# EasyEDA Pro project FD-MGS-A.eprj

# Schematic 光栅光谱仪
Board Name: FD-MGS-A; Create Date: 2025-05-20; Page Name: P1; Project Name: guangsha; Schematic Name: 光栅光谱仪; Update Date: 2025-08-22; Company: 嘉立创EDA; Page Size: A4; Version: V1.0
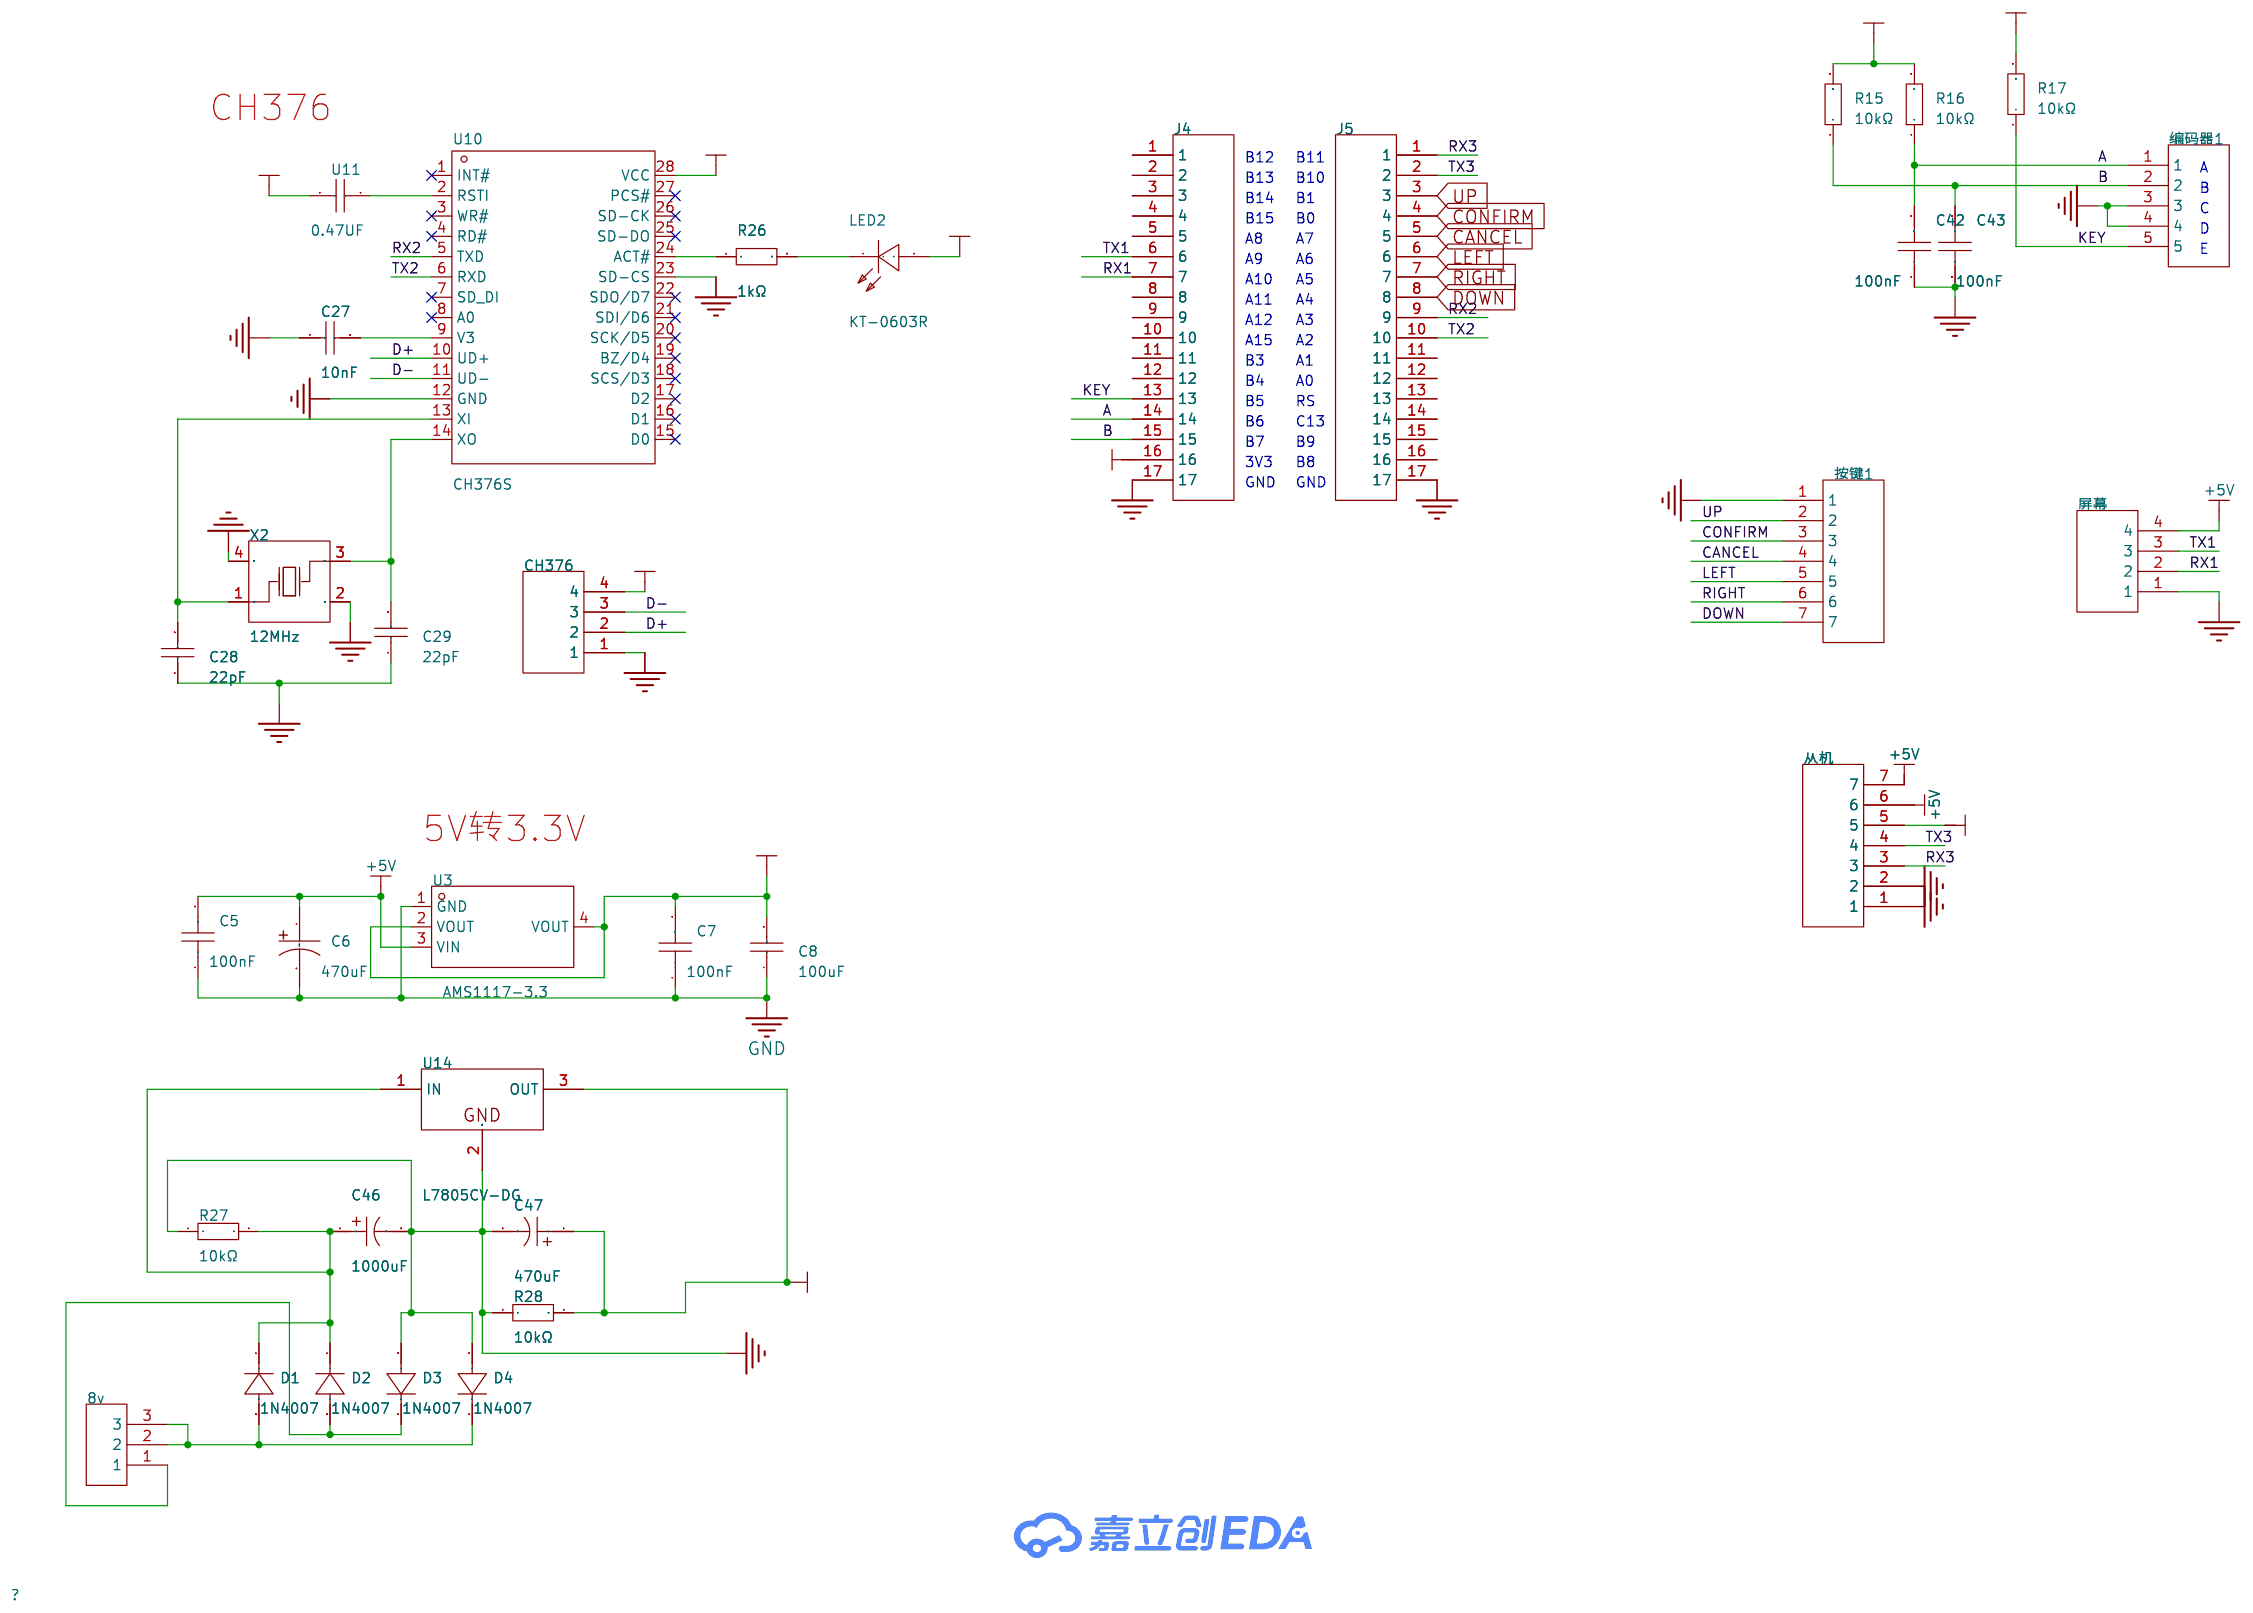
[diagram p0: schematic sheet]

## Parts
8v  -  [CH2.54-3插座]
C5  100nF  [C0603]
C6  470uF  [cap-th_bd8.0-p3.50-d0.6-fd_1]
C7  100nF  [C0603]
C8  100uF  [C1206]
C27  10nF  [C0603]
C28  22pF  [C0603]
C29  22pF  [C0603]
C42  100nF  [C0402]
C43  100nF  [C0402]
C46  1000uF  [CAP-TH_BD10.0-P5.00-D0.6-FD]
C47  470uF  [CAP-TH_BD8.0-P3.50-D0.5-FD]
CH376  -  [CH2.54-4插座]
D1  1N4007  [DO-41_BD2.4-L4.7-P8.70-D0.8-RD]
D2  1N4007  [DO-41_BD2.4-L4.7-P8.70-D0.8-RD]
D3  1N4007  [DO-41_BD2.4-L4.7-P8.70-D0.8-RD]
D4  1N4007  [DO-41_BD2.4-L4.7-P8.70-D0.8-RD]
J4  -  [CH2.54-17P]
J5  -  [CH2.54-17P]
LED2  KT-0603R  [LED0603-RD]
R15  10kΩ  [R0805]
R16  10kΩ  [R0805]
R17  10kΩ  [R0805]
R26  1kΩ  [R0603]
R27  10kΩ  [Res_1/8W]
R28  10kΩ  [Res_1/8W]
U3  AMS1117-3.3  [SOT-223-3_L6.5-W3.4-P2.30-LS7.0-BR]
U10  CH376S  [SOIC-28_L17.9-W7.5-P1.27-LS10.3-BL]
U11  0.47UF  [C0603]
U14  L7805CV-DG  [TO-220-3_L10.0-W4.5-P2.54-L]
X2  12MHz  [CRYSTAL-SMD_4P-L3.2-W2.5-BL]
从机  -  [CH2.54-7插座]
屏幕  -  [CH2.54-4插座]
按键1  -  [CH2.54-7插座]
编码器1  -  [CH2.54-5插座]

## Library data of the parts
8v = HDR-3P
C5 C7 = CAP_0603: Supplier Footprint: 0603
C6 = RVT1A471M0607_C335982: 容值:470uF;精度:±20%;额定电压:10V;纹波电流:200mA@120Hz;等效串联电阻:-;; LCSC Part Name: 470uF ±20% 10V; Supplier Part: C335982; Manufacturer: ROQANG(容强); Manufacturer Part: RVT1A471M0607; Supplier Footprint: SMD,D6.3xL7.7mm; Datasheet: https://atta.szlcsc.com/upload/public/pdf/source/20181128/C335987_23CA7AA50FB42690DF736C43FE112376.pdf; Supplier: LCSC; Tolerance: ±20%; Rated Voltage: 10V; Ripple Current: 200mA@120Hz; φD: 6.3mm; L: 7.7mm; Lifetime @ Temp: 2000hrs@105℃; Operating Temperature: -40℃~+105℃
C8 = CL31A107MQHNNNE: 容值:100uF;精度:±20%;额定电压:6.3V;材质(温度系数):X5R;; LCSC Part Name: 100uF ±20% 6.3V; Supplier Part: C15008; Manufacturer: SAMSUNG(三星); Supplier Footprint: 1206; Datasheet: https://atta.szlcsc.com/upload/public/pdf/source/20160218/1457707763339.pdf; Supplier: LCSC; Tolerance: ±20%; Voltage Rated: 6.3V; Temperature Coefficient: X5R
C27 = 0603B103K500NT: 容值:10nF;精度:±10%;额定电压:50V;材质(温度系数):X7R;; LCSC Part Name: 10nF ±10% 50V; Supplier Part: C57112; Manufacturer: FH(风华); Supplier Footprint: 0603; JLCPCB Part Class: 基础库; Datasheet: https://atta.szlcsc.com/upload/public/pdf/source/20200305/C486355_26A10D38EF8C2A5C37091D0039909270.pdf; Supplier: LCSC; Tolerance: ±10%; Voltage Rated: 50V; Temperature Coefficient: X7R
C28 C29 = CL10C220JB8NNNC: 容值:22pF;精度:±5%;额定电压:50V;材质(温度系数):C0G;; LCSC Part Name: 22pF ±5% 50V; Supplier Part: C1653; Manufacturer: SAMSUNG(三星); Supplier Footprint: 0603; JLCPCB Part Class: 基础库; Datasheet: https://atta.szlcsc.com/upload/public/pdf/source/20160218/1457707763339.pdf; Supplier: LCSC; Tolerance: ±5%; Voltage Rated: 50V; Temperature Coefficient: C0G
C42 C43 = CL05B104KB54PNC: 容值:100nF;精度:±10%;额定电压:50V;材质(温度系数):X7R;; LCSC Part Name: 100nF ±10% 50V; Supplier Part: C307331; Manufacturer: SAMSUNG(三星); Supplier Footprint: 0402; JLCPCB Part Class: 基础库; Datasheet: https://atta.szlcsc.com/upload/public/pdf/source/20160218/1457707763339.pdf; Supplier: LCSC; Tolerance: ±10%; Voltage Rated: 50V; Temperature Coefficient: X7R
C46 = CD288108M1V1020VFL: 容值:1000uF;额定电压:35V;; LCSC Part Name: 1000uF 35V; Supplier Part: C7499950; Manufacturer: HRK(鸿瑞凯电子); Supplier Footprint: 插件,D10xL20mm; JLCPCB Part Class: 扩展库; Datasheet: https://item.szlcsc.com/datasheet/CD288108M1V1020VFL/8575810.html; Supplier: LCSC; Voltage Rating: 35V; Diameter: 10mm; Height - Seated (Max): 20mm
C47 = 16V470uF CD288: 容值:470uF;精度:±20%;额定电压:16V;; LCSC Part Name: 470uF ±20% 16V; Supplier Part: C2960229; Manufacturer: HRK(鸿瑞凯电子); Supplier Footprint: 插件,D8xL12mm; JLCPCB Part Class: 扩展库; Supplier: LCSC; Tolerance: ±20%; Voltage Rating: 16V; Pin Spacing: 3.5mm; Diameter: 8mm; Height - Seated (Max): 12mm; Operating Temperature: -40℃~+105℃
CH376 屏幕 = HDR-4P
D1-D4 = 1N4007_C2985028: 二极管配置:独立式;正向压降(Vf):1V@1A;直流反向耐压(Vr):1kV;整流电流:1A;; LCSC Part Name: 电压:1kV 电流:1A; Supplier Part: C2985028; Manufacturer: GOODWORK(固得沃克); Supplier Footprint: DO-41; JLCPCB Part Class: 扩展库; Datasheet: https://item.szlcsc.com/datasheet/1N4007/3428711.html; Supplier: LCSC; Diode Configuration: 独立式; Voltage - Forward(Vf@If): 1V@1A; Voltage - DC Reverse(Vr): 1kV; Current - Rectified: 1A; Reverse Leakage Current (Ir): 5uA@1kV; Non-Repetitive Peak Forward Surge Current: 30A; Operating Junction Temperature Range: -65℃~+150℃
J4 J5 = HDR-17P
LED2 = KT-0603R: 发光颜色:红色;功率:-;正向电流:-;主波长:-;二极管配置:-;透镜颜色:-;色温:-;发光角度:-;载带方式:-;工作温度:-40℃~+85℃;; LCSC Part Name: 0603 红灯 高亮; Supplier Part: C2286; Manufacturer: KENTO; Supplier Footprint: 0603; JLCPCB Part Class: 基础库; Datasheet: https://atta.szlcsc.com/upload/public/pdf/source/20160616/1466072038404.pdf; Supplier: LCSC; Emitted Color: 红色; Operating Temperature: -40℃~+85℃
R15-R17 = 0805W8F1002T5E_C17414: 电阻类型:厚膜电阻;阻值:10kΩ;精度:±1%;功率:125mW;最大工作电压:150V;温度系数:±100ppm/℃;; LCSC Part Name: 10kΩ ±1% 125mW 厚膜电阻; Supplier Part: C17414; Manufacturer: UNI-ROYAL(厚声); Manufacturer Part: 0805W8F1002T5E; Supplier Footprint: 0805; JLCPCB Part Class: 基础库; Datasheet: https://atta.szlcsc.com/upload/public/pdf/source/20200306/C422600_1E6D84923E4A46A82E41ADD87F860B5C.pdf; Supplier: LCSC; Type: 厚膜电阻; Tolerance: ±1%; Power(Watts): 125mW; Overload Voltage (Max): 150V; Temperature Coefficient: ±100ppm/℃; Operating Temperature Range: -55℃~+155℃
R26 = 0603WAF1001T5E: 电阻类型:厚膜电阻;阻值:1kΩ;精度:±1%;功率:100mW;最大工作电压:75V;温度系数:±100ppm/℃;; LCSC Part Name: 1kΩ ±1% 100mW 厚膜电阻; Supplier Part: C21190; Manufacturer: UNI-ROYAL(厚声); Supplier Footprint: 0603; JLCPCB Part Class: 基础库; Datasheet: https://atta.szlcsc.com/upload/public/pdf/source/20200306/C422600_1E6D84923E4A46A82E41ADD87F860B5C.pdf; Supplier: LCSC; Type: 厚膜电阻; Tolerance: ±1%; Power(Watts): 100mW; Overload Voltage (Max): 75V; Temperature Coefficient: ±100ppm/℃; Operating Temperature Range: -55℃~+155℃
R27 R28 = Res_AXIAL-1/8W: Supplier Footprint: 轴向引线
U3 = AMS1117-3.3_C6186: 输出类型:固定;最大输入电压:-;输出电压:3.3V;最大输出电流:1A;电源纹波抑制比(PSRR):72dB@(120Hz);输出极性:正极;; LCSC Part Name: 输出3.3V 1A; Supplier Part: C6186; Manufacturer: AMS; Supplier Footprint: SOT-223; Datasheet: https://atta.szlcsc.com/upload/public/pdf/source/20180727/C6186_7A095716F0823C02F1997A905E26C086.pdf; Supplier: LCSC; Output Type: 固定; Output Voltage: 3.3V; MAX Output Current: 1A; Power Supply Rejection Ratio (PSRR): 72dB@(120Hz); Dropout Voltage: 1.3V@(800mA); Output Polarity: 正极; Number of Outputs: 1
U10 = CH376S: 应用功能:-;接口协议:USB 2.0;数据速率:12Mbps;; Supplier Part: C14166; Manufacturer: WCH(南京沁恒); Supplier Footprint: SOP-28-300mil; JLCPCB Part Class: 扩展库; Datasheet: https://atta.szlcsc.com/upload/public/pdf/source/20240313/780B8519D8DF2DCF0D579C39FFA4C063.pdf; Supplier: LCSC; Protocol: USB 2.0; Voltage - Supply: 3.3V；5V; Data Rate: 12Mbps; Supply Voltage: 3.3V；5V
U11 = CAPCER0.47UF25VX7R0603: Supplier Part: C9900012837; JLCPCB Part Class: 扩展库; Supplier: LCSC
U14 = L7805CV-DG: 输出类型:固定;最大输入电压:35V;输出电压:5V;输出电流:1.5A;电源纹波抑制比(PSRR):62dB@(120Hz);输出极性:正极;; LCSC Part Name: 正稳压器IC; Supplier Part: C3795; Manufacturer: ST(意法半导体); Supplier Footprint: TO-220; JLCPCB Part Class: 扩展库; Datasheet: https://atta.szlcsc.com/upload/public/pdf/source/20140724/1457707163191.pdf; Supplier: LCSC; Output Type: 固定; Maximum Input Voltage: 35V; Output Voltage: 5V; Output Current: 1.5A; Power Supply Rejection Ratio (PSRR): 62dB@(120Hz); Dropout Voltage: 2V@(1A); standby current: 8mA; Feature: 短路保护；热保护(TSD)；过流保护(OCP); Operating Temperature: 0℃~+125℃; Output Polarity: 正极; Number of Outputs: 1
X2 = X322512MSB4SI: 晶振类型:贴片晶振;频率:12MHz;常温频差:±10ppm;外接负载电容:20pF;频率稳定度(全温):±20ppm;; LCSC Part Name: 12MHz ±10ppm 20pF; Supplier Part: C9002; Manufacturer: YXC(扬兴晶振); Supplier Footprint: SMD3225-4P; JLCPCB Part Class: 基础库; Datasheet: https://atta.szlcsc.com/upload/public/pdf/source/20240329/19D5F850207469550BEB00D7DFEDBC7A.pdf; Supplier: LCSC; Crystal Type: 贴片晶振; Normal temperature Frequency Tolerance: ±10ppm; External load capacitor: 20pF; Frequency Stability(Full temperature range): ±20ppm; Operating Temperature: -40℃~+85℃
从机 按键1 = HDR-7P
编码器1 = HDR-5P

## Nets
+3V3: C7.2 C8.2 J4.16 LED2.2(A) R15.2 R16.2 R17.2 U3.2(VOUT) U3.4(VOUT) U10.28(VCC) U11.1 从机.5
+5V: C5.2 C6.1 C47.1 CH376.4 R28.2 U3.3(VIN) U14.3(OUT) 从机.6 从机.7 屏幕.4
GND: C5.1 C6.2 C7.1 C8.1 C27.1 C28.1 C29.1 C42.1 C43.1 C46.2 C47.2 CH376.1 D3.2(A) D4.2(A) J4.17 J5.17 R27.1 R28.1 U3.1(GND) U10.12(GND) U10.23(SD-CS) U14.2(GND) X2.2(GND) X2.4(GND) 从机.1 从机.2 屏幕.1 按键1.1 编码器1.3 编码器1.4
A: C42.2 J4.14 R16.1 编码器1.1
B: C43.2 J4.15 R15.1 编码器1.2
CANCEL: J5.5 按键1.4
CONFIRM: J5.4 按键1.3
D+: CH376.2 U10.10(UD+)
D-: CH376.3 U10.11(UD-)
DOWN: J5.8 按键1.7
KEY: J4.13 R17.1 编码器1.5
LEFT: J5.6 按键1.5
RIGHT: J5.7 按键1.6
RX1: J4.7 屏幕.2
RX2: J5.9 U10.5(TXD)
RX3: J5.1 从机.3
TX1: J4.6 屏幕.3
TX2: J5.10 U10.6(RXD)
TX3: J5.2 从机.4
UP: J5.3 按键1.2
$1N2323: R26.1 U10.24(ACT#)
$1N2324: LED2.1(K) R26.2
$1N2327: U10.2(RSTI) U11.2
$1N2339: C27.2 U10.9(V3)
$1N2342: C28.2 U10.13(XI) X2.1(OSC1)
$1N2343: C29.2 U10.14(XO) X2.3(OSC2)
$1N13204: 8v.2 8v.3 D1.2(A) D4.1(K)
$1N13283: C46.1 D1.1(K) D2.1(K) R27.2 U14.1(IN)
$1N13747: 8v.1 D2.2(A) D3.1(K)

Not connected (* = marked no-connect by the designer): J4 1 2 3 4 5 8 9 10 11 12; J5 11 12 13 14 15 16; U10 1(INT#)* 3(WR#)* 4(RD#)* 7(SD_DI)* 8(A0)* 15(D0)* 16(D1)* 17(D2)* 18(SCS/D3)* 19(BZ/D4)* 20(SCK/D5)* 21(SDI/D6)* 22(SDO/D7)* 25(SD-DO)* 26(SD-CK)* 27(PCS#)*

## Notes on the sheet
- CH376
- B12
- B11
- B13
- B10
- A
- B14
- B1
- B
- C
- B15
- B0
- D
- A8
- A7
- E
- A10
- A9
- A5
- A6
- A11
- A4
- A12
- A3
- A15
- A2
- B3
- A1
- B4
- A0
- B5
- B6
- C13
- RS
- B7
- B9
- 3V3
- B8
- GND
- GND
- 5V转3.3V

# Board PCB1
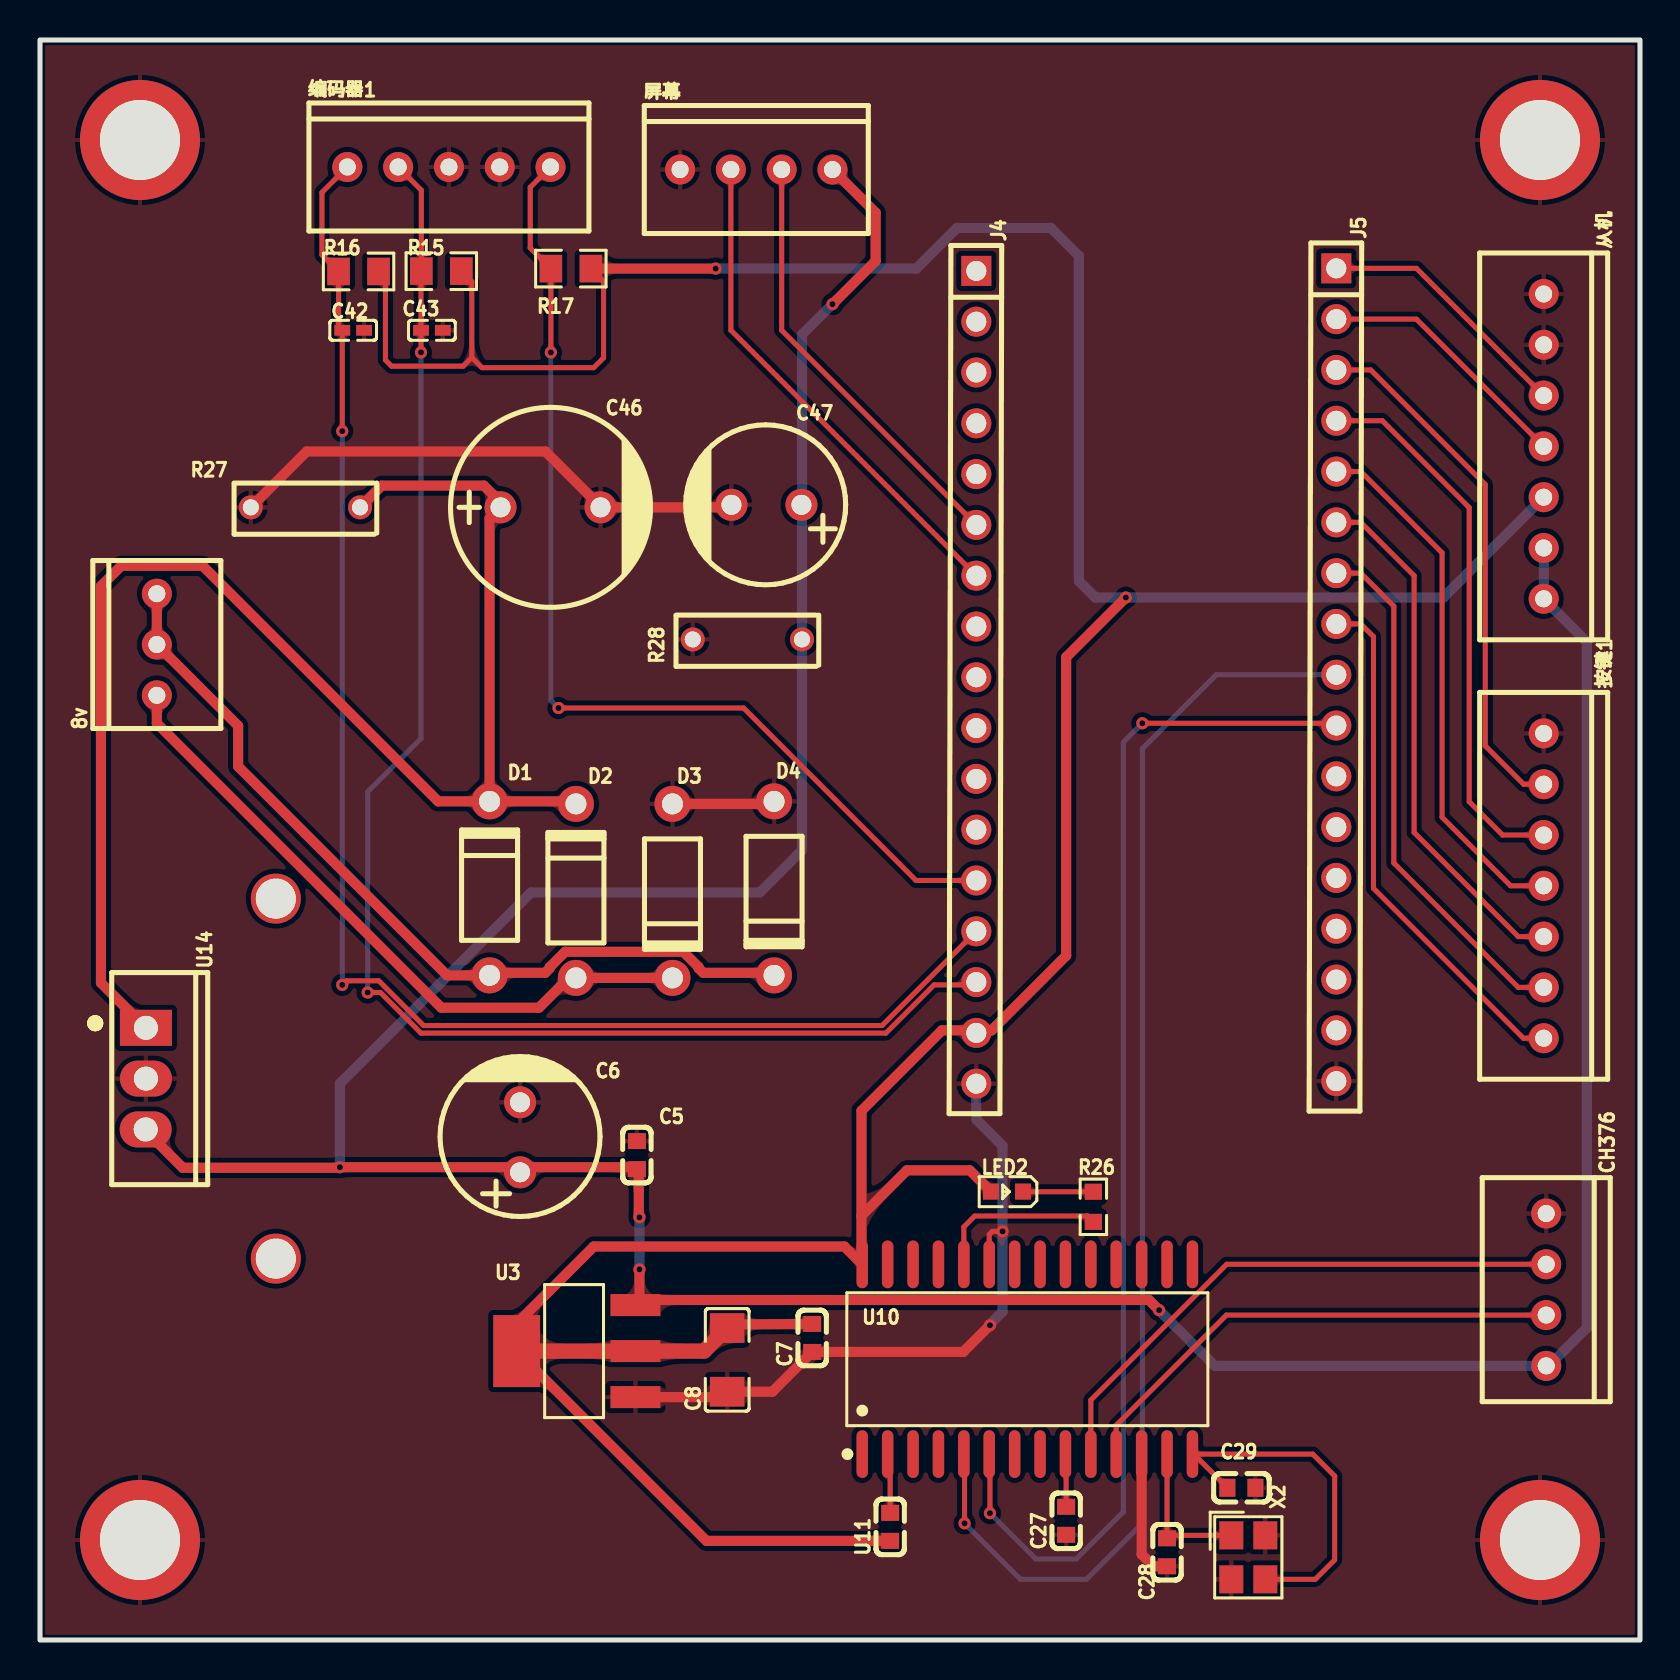
[diagram p1: board, top side]
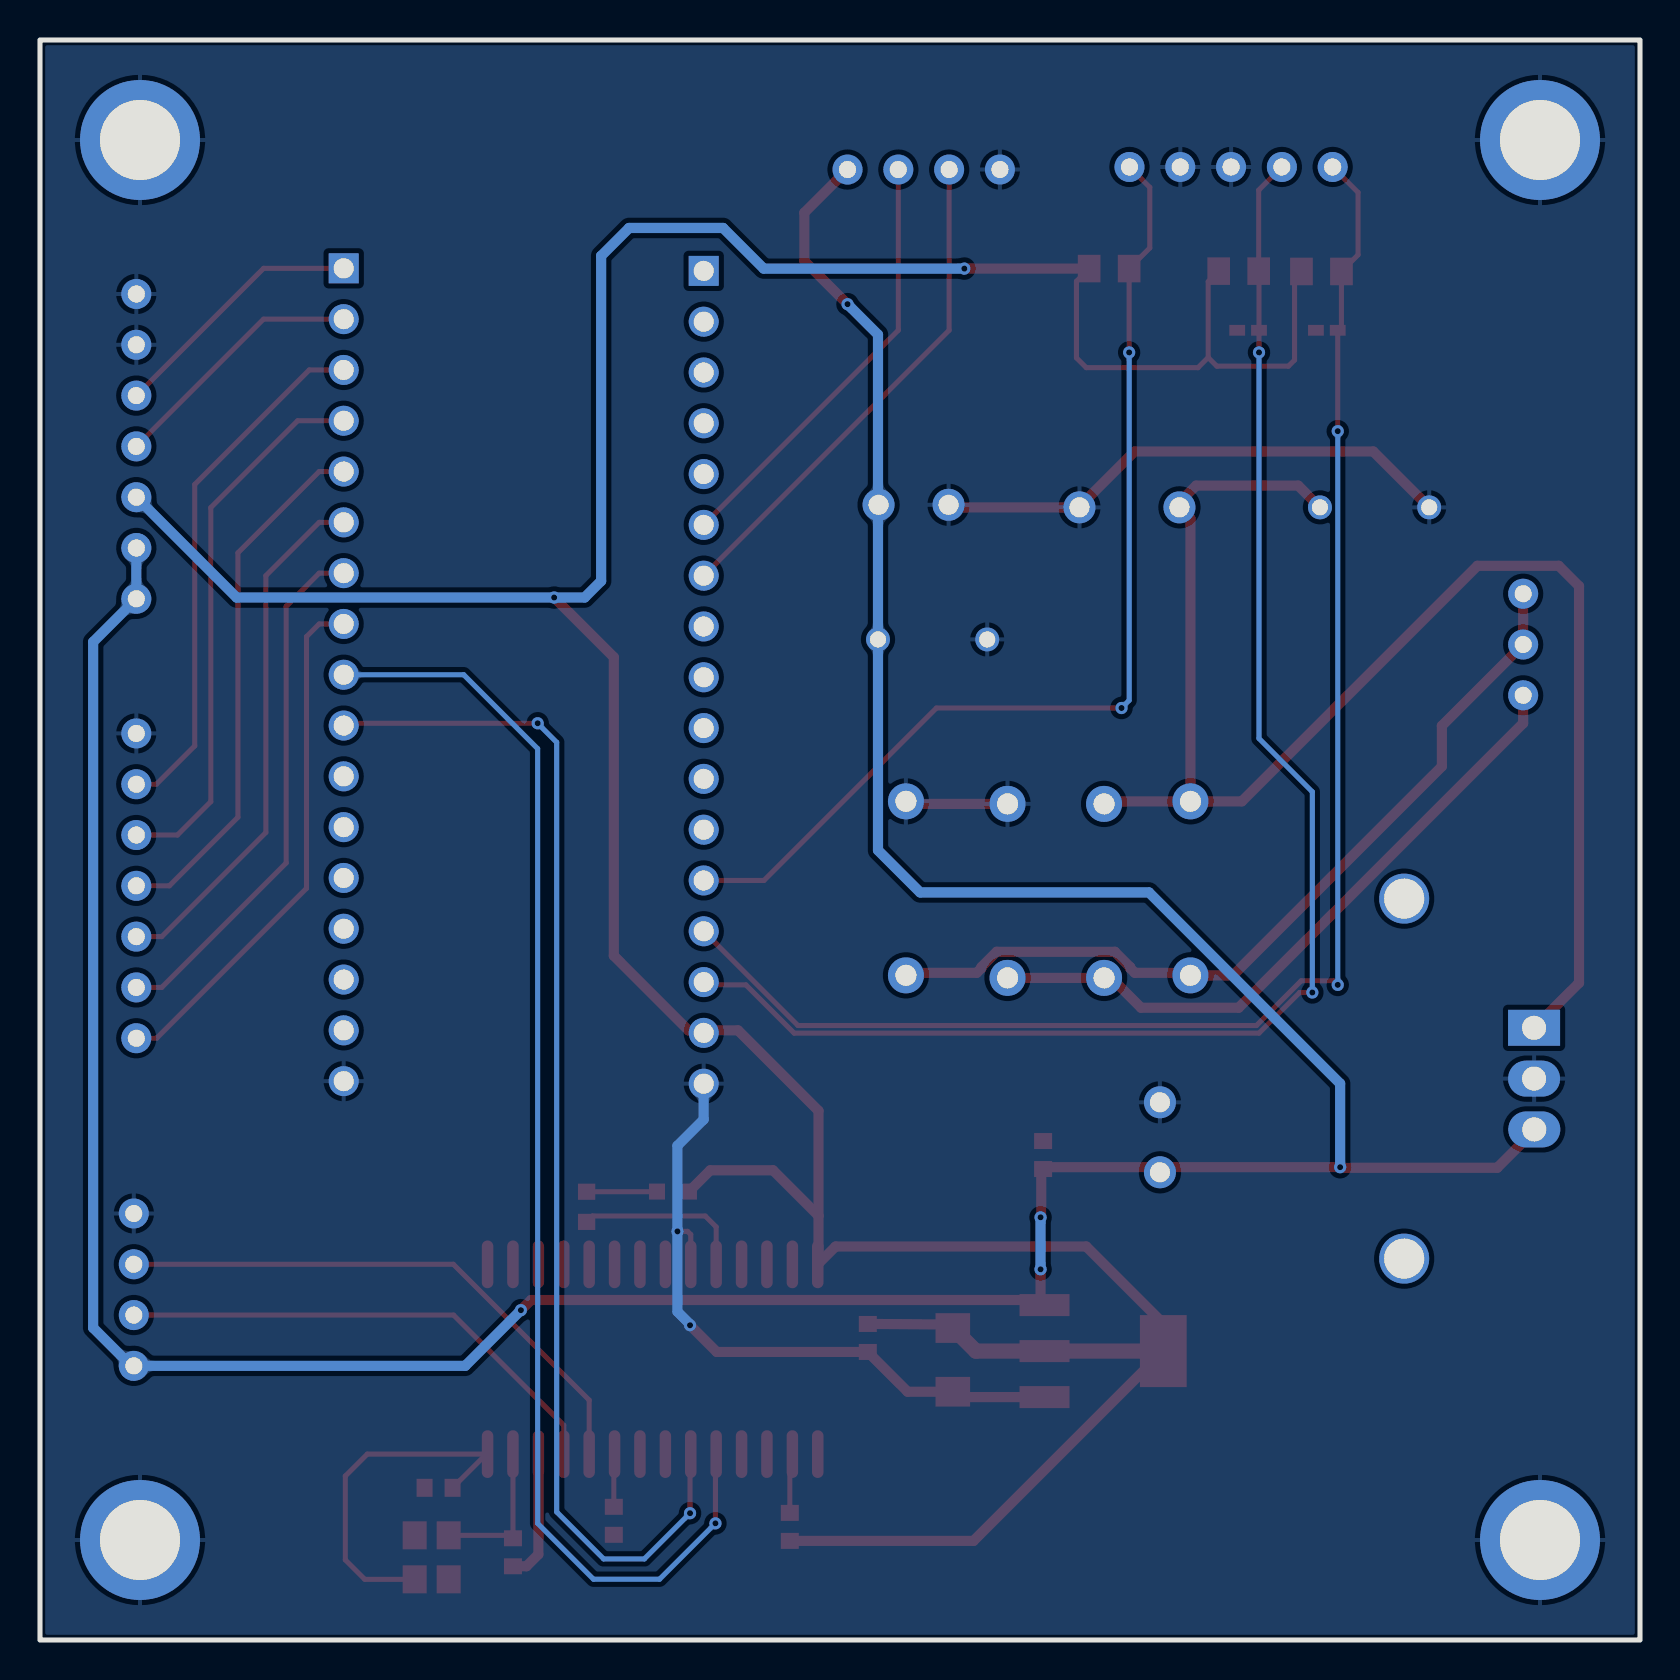
[diagram p2: board, bottom side, seen from below]

Outline 80 x 80 mm; copper layers: Top Layer, Bottom Layer. Coordinates in mm from the lower left corner of the outline.
Outline path: rectangle 0,80 80,0
Stack: Top Layer 0.035mm / Dielectric1 1.51mm FR4 er 4.5 / Bottom Layer 0.035mm

## Design rules (mm)
template: JLCPCB Capability(Multiple Layers Board)
spacing copperThickness1oz (default): track to track 0.102, other pairs 0.152 to 0.3
spacing copperThickness2oz: track to track 0.203, other pairs 0.152 to 0.3
spacing copperThicknessInner0.5oz: track to track 0.089, other pairs 0.152 to 0.3
track width copperThickness1oz (default): min 0.102, default 0.254, max 2.54
track width copperThickness2oz: min 0.203, default 0.254, max 2.54
track width copperThickness0.5oz: min 0.089, default 0.254, max 2.54
differential pair differentialPair (default): width min 0.127, default 0.254, max 2.54; gap min 0.152, default 0.152
via viaSize (default): diameter min 0.3, default 0.61, max 10; hole min 0.2, default 0.305, max 6.3

## Placement (name value [footprint] x y rotation side)
8v  -  [CH2.54-3插座]  5.84 49.77 90 top
C5  100nF  [C0603]  29.84 24.25 270 top
C6  470uF  [cap-th_bd8.0-p3.50-d0.6-fd_1]  24 25.14 90 top
C7  100nF  [C0603]  38.61 15.1 90 top
C8  100uF  [C1206]  34.36 14.01 90 top
C27  10nF  [C0603]  51.31 5.96 90 top
C28  22pF  [C0603]  56.35 4.39 90 top
C29  22pF  [C0603]  60.07 7.61 180 top
C42  100nF  [C0402]  15.66 65.48 180 top
C43  100nF  [C0402]  19.59 65.48 180 top
C46  1000uF  [CAP-TH_BD10.0-P5.00-D0.6-FD]  25.53 56.63 0 top
C47  470uF  [CAP-TH_BD8.0-P3.50-D0.5-FD]  36.32 56.76 180 top
CH376  -  [CH2.54-4插座]  75.31 17.52 270 top
D1  1N4007  [DO-41_BD2.4-L4.7-P8.70-D0.8-RD]  22.48 37.58 270 top
D2  1N4007  [DO-41_BD2.4-L4.7-P8.70-D0.8-RD]  26.8 37.45 270 top
D3  1N4007  [DO-41_BD2.4-L4.7-P8.70-D0.8-RD]  31.62 37.45 90 top
D4  1N4007  [DO-41_BD2.4-L4.7-P8.70-D0.8-RD]  36.7 37.58 90 top
J4  -  [CH2.54-17P]  46.76 48.12 270 top
J5  -  [CH2.54-17P]  64.76 48.25 270 top
LED2  KT-0603R  [LED0603-RD]  48.35 22.42 180 top
NOREF  -  [Pad_e1149]  5 75 0 top
NOREF#2  -  [Pad_e1150]  75 75 0 top
NOREF#3  -  [Pad_e1195]  75 5 0 top
NOREF#4  -  [Pad_e851]  11.79 37.07 270 top
NOREF#5  -  [Pad_e45]  5 5 0 top
NOREF#6  -  [Pad_e846]  11.79 19.07 270 top
R15  10kΩ  [R0805]  20.07 68.44 0 top
R16  10kΩ  [R0805]  15.93 68.43 0 top
R17  10kΩ  [R0805]  26.54 68.57 0 top
R26  1kΩ  [R0603]  52.67 21.66 90 top
R27  10kΩ  [Res_1/8W]  11.3 56.89 0 top
R28  10kΩ  [Res_1/8W]  33.4 50.28 0 top
U3  AMS1117-3.3  [SOT-223-3_L6.5-W3.4-P2.30-LS7.0-BR]  26.8 14.44 0 top
U10  CH376S  [SOIC-28_L17.9-W7.5-P1.27-LS10.3-BL]  49.37 14.04 0 top
U11  0.47UF  [C0603]  42.51 5.66 90 top
U14  L7805CV-DG  [TO-220-3_L10.0-W4.5-P2.54-L]  5.29 28.07 270 top
X2  12MHz  [CRYSTAL-SMD_4P-L3.2-W2.5-BL]  60.42 4.13 270 top
从机  -  [CH2.54-7插座]  75.18 59.68 270 top
屏幕  -  [CH2.54-4插座]  35.81 73.52 0 top
按键1  -  [CH2.54-7插座]  75.18 37.71 270 top
编码器1  -  [CH2.54-5插座]  20.45 73.65 0 top

## Footprints (pads in the part's own frame, mm; a bottom-side part is the same pattern mirrored in y, then rotated)
C0402
  rect 0.79x0.54 smd: 1(-0.545,0) 2(0.545,0)
C0603
  rect 0.8x0.9 smd: 1(-0.7,0) 2(0.7,0)
C1206
  rect 1.485x1.728 smd: 1(-1.593,0) 2(1.593,0)
CAP-TH_BD8.0-P3.50-D0.5-FD
  round 1.6 hole 1: 1(-1.75,0) 2(1.75,0)
cap-th_bd8.0-p3.50-d0.6-fd_1
  round 1.6 hole 1: 1(-1.75,0) 2(1.75,0)
CAP-TH_BD10.0-P5.00-D0.6-FD
  round 1.6 hole 1: 1(-2.5,0) 2(2.5,0)
CH2.54-3插座
  round 1.5 hole 0.85: 1(-2.54,0) 2(0,0) 3(2.54,0)
CH2.54-4插座
  round 1.5 hole 0.85: 1(-3.81,0) 2(-1.27,0) 3(1.27,0) 4(3.81,0)
CH2.54-5插座
  round 1.5 hole 0.85: 1(-5.08,0) 2(-2.54,0) 3(0,0) 4(2.54,0) 5(5.08,0)
CH2.54-7插座
  round 1.5 hole 0.85: 1(-7.62,0) 2(-5.08,0) 3(-2.54,0) 4(0,0) 5(2.54,0) 6(5.08,0) 7(7.62,0)
CH2.54-17P
  rect 1.5x1.5 hole 1: 1(-20.332,0.051)
  round 1.5 hole 1: 2(-17.793,0.051) 3(-15.252,0.051) 4(-12.713,0.051) 5(-10.172,0.051) 6(-7.633,0.051) 7(-5.093,0.051) 8(-2.553,0.051) 9(-0.013,0.051) 10(2.527,0.051) 11(5.067,0.051) 12(7.607,0.051) 13(10.148,0.051) 14(12.688,0.051) 15(15.227,0.051) 16(17.767,0.051) 17(20.308,0.051)
CRYSTAL-SMD_4P-L3.2-W2.5-BL
  rect 1.4x1.2 smd: 1(-1.1,-0.85) 2(1.1,-0.85) 3(1.1,0.85) 4(-1.1,0.85)
DO-41_BD2.4-L4.7-P8.70-D0.8-RD
  round 1.8 hole 1.05: 1(-4.35,0) 2(4.35,0)
LED0603-RD
  rect 0.8x0.8 smd: 1(-0.799,0) 2(0.799,0)
Pad_e45
  round 6 hole 4: 1(0,0)
Pad_e846
  round 2.5 hole 2: 1(0,0)
Pad_e851
  round 2.5 hole 2: 1(0,0)
Pad_e1149
  round 6 hole 4: 1(0,0)
Pad_e1150
  round 6 hole 4: 1(0,0)
Pad_e1195
  round 6 hole 4: 1(0,0)
R0603
  rect 0.806x0.864 smd: 1(-0.753,0) 2(0.753,0)
R0805
  rect 1.133x1.377 smd: 1(-1,0) 2(1,0)
Res_1/8W
  round 1.199 hole 0.8: 1(-0.762,-0.254) 2(4.699,-0.254)
SOIC-28_L17.9-W7.5-P1.27-LS10.3-BL
  oval 0.574x2.388 smd: 1(-8.255,-4.744) 2(-6.985,-4.744) 3(-5.715,-4.744) 4(-4.445,-4.744) 5(-3.175,-4.744) 6(-1.905,-4.744) 7(-0.635,-4.744) 8(0.635,-4.744) 9(1.905,-4.744) 10(3.175,-4.744) 11(4.445,-4.744) 12(5.715,-4.744) 13(6.985,-4.744) 14(8.255,-4.744) 15(8.255,4.744) 16(6.985,4.744) 17(5.715,4.744) 18(4.445,4.744) 19(3.175,4.744) 20(1.905,4.744) 21(0.635,4.744) 22(-0.635,4.744) 23(-1.905,4.744) 24(-3.175,4.744) 25(-4.445,4.744) 26(-5.715,4.744) 27(-6.985,4.744) 28(-8.255,4.744)
SOT-223-3_L6.5-W3.4-P2.30-LS7.0-BR
  rect 2.5x1.1 smd: 1(2.97,-2.3) 2(2.97,0) 3(2.97,2.3)
  rect 2.34x3.6 smd: 4(-2.97,0)
TO-220-3_L10.0-W4.5-P2.54-L
  rect 1.8x2.6 hole 1.2: 1(-2.54,0.005)
  oval 1.8x2.6 hole 1.2: 2(0,0.005) 3(2.54,-0.005)

## Nets
As in the schematic, except:
GND: C5.1 C6.2 C7.1 C8.1 C27.1 C28.1 C29.1 C42.1 C43.1 C46.2 C47.2 CH376.1 D3.2 D4.2 J4.17 J5.17 NOREF.1 NOREF#2.1 NOREF#3.1 NOREF#5.1 R27.1 R28.1 U3.1 U10.12 U10.23 U14.2 X2.2 X2.4 从机.1 从机.2 屏幕.1 按键1.1 编码器1.3 编码器1.4

Pads without a net: J4 1 2 3 4 5 8 9 10 11 12; J5 11 12 13 14 15 16; NOREF#4 1; NOREF#6 1; U10 1 3 4 7 8 15 16 17 18 19 20 21 22 25 26 27

## Via types
v1: diameter 0.61, hole 0.305, Top Layer to Bottom Layer, 18 vias

## Routing (per net, layer and track width the routed paths; a pad name or vN(x,y) marks a point on that pad's centre or on a via; arc(x,y) is an arc through that point)
+3V3: length 199.6
  Top Layer w0.254: R16.2 17.27,68.08 17.27,64 17.58,63.69 21.16,63.69 21.59,64.12 ; R17.2 28.18,67.94 28.18,64.11 27.69,63.62 22.1,63.62 21.59,64.12 ; 21.59,64.12 21.59,67.92 R15.2
  Top Layer w0.508: 41.07,21.21 43.35,23.48 46.49,23.48 LED2.2 ; 41.07,21.21 41.07,26.46 45.1,30.48 47.58,30.48 51.31,34.21 51.31,49.14 v1(54.29,52.12) ; 41.07,21.21 41.07,18.82 ; R17.2 v1(33.78,68.57) ; 34.54,15.78 C7.2 ; 41.07,18.82 U10.28 ; 41.07,18.82 40.22,19.68 27.69,19.68 23.83,15.82 U3.4 33.32,4.96 42.51,4.96
  Top Layer w0.762: C8.2 33.21,14.44 U3.4
  Bottom Layer w0.508: v1(33.78,68.57) 43.81,68.57 45.85,70.6 50.55,70.6 51.94,69.2 51.94,52.95 52.77,52.12 v1(54.29,52.12) 70.17,52.12 从机.5
+5V: length 190.4
  Top Layer w0.508: v1(39.62,66.79) 41.78,68.95 41.78,71.36 屏幕.4 ; 29.97,16.94 30.03,17 55.45,17 v1(55.96,16.49) ; 29.97,16.94 29.77,16.75 ; 29.97,16.94 v1(29.97,18.53) ; v1(29.97,21.13) 29.94,21.17 29.94,23.61 29.9,23.64 v1(14.99,23.64) 14.97,23.61 7.14,23.61 5.22,25.53
  Bottom Layer w0.508: 从机.6 从机.7 77.34,49.9 77.34,15.61 75.44,13.71 ; CH376.4 58.74,13.71 v1(55.96,16.49) ; v1(29.97,21.13) v1(29.97,18.53) ; v1(14.99,23.64) 14.99,27.82 24.55,37.38 35.99,37.38 38.1,39.49 R28.2 38.1,65.27 v1(39.62,66.79)
GND: length 72.2
  Top Layer w0.254: U10.23 47.46,20.27 47.62,20.43 v1(48.13,20.43)
  Top Layer w0.508: C28.1 55.68,3.69 55.08,4.28 U10.12 ; D4.2 36.58,41.81 D3.2 ; v1(47.5,15.74) 46.16,14.4 C7.1 36.62,12.41 C8.1 34.09,12.15 29.77,12.15 ; C47.2 34.44,56.63 28.07,56.63 25.27,59.43 13.33,59.43 R27.1
  Bottom Layer w0.508: J4.17 46.81,26.03 48.13,24.71 v1(48.13,20.43) 48.13,16.42 47.58,15.87
A: length 76.5
  Top Layer w0.254: 编码器1.1 14.1,72.38 14.1,69.26 R16.1 14.93,65.67 C42.2 v1(15.11,60.44) ; J4.14 42.1,30.72 19.18,30.72 16.94,32.96 15.32,32.96 v1(15.11,32.76)
  Bottom Layer w0.254: v1(15.11,60.44) v1(15.11,32.76)
B: length 75.2
  Top Layer w0.254: v1(19.05,64.38) C43.2 19.05,68.43 R15.1 19.07,72.49 编码器1.2 ; J4.15 46.68,32.76 44.7,32.76 42.29,30.34 19.05,30.34 17.02,32.38 v1(16.38,32.38)
  Bottom Layer w0.254: v1(19.05,64.38) 19.05,45.08 16.38,42.41 v1(16.38,32.38)
CANCEL: length 26.7
  Top Layer w0.254: 按键1.4 73.53,37.71 70.1,41.14 70.1,54.36 66.04,58.42 J5.5
CONFIRM: length 27.6
  Top Layer w0.254: 75.18,40.25 73.13,40.25 71.46,41.92 71.46,56.62 67.12,60.96 J5.4
D+: length 28.3
  Top Layer w0.254: CH376.2 59.33,18.79 52.54,12 U10.10
D-: length 25.2
  Top Layer w0.254: CH376.3 59.32,16.25 53.81,10.74 U10.11
DOWN: length 26.3
  Top Layer w0.254: 按键1.7 74.17,30.09 66.68,37.58 66.68,50.17 66.04,50.8 J5.8
KEY: length 52.5
  Top Layer w0.254: 编码器1.5 24.51,72.63 24.51,69.6 R17.1 v1(25.54,64.38) ; J4.13 43.8,37.98 35.18,46.6 v1(25.92,46.6)
  Bottom Layer w0.254: v1(25.92,46.6) 25.54,46.98 v1(25.54,64.38)
LEFT: length 26.5
  Top Layer w0.254: 按键1.5 73.91,35.17 68.71,40.38 68.71,53.22 66.04,55.88 J5.6
RIGHT: length 26.5
  Top Layer w0.254: J5.7 66.04,53.34 67.69,51.69 67.69,38.85 73.91,32.63 按键1.6
RX1: length 25.4
  Top Layer w0.254: 屏幕.2 34.54,65.49 J4.7
RX2: length 64.6
  Top Layer w0.254: U10.5 46.23,9.26 v1(46.23,5.83)
  Bottom Layer w0.254: J5.9 58.81,48.26 55.12,44.57 55.12,5.83 52.32,3.04 49.02,3.04 v1(46.23,5.83)
RX3: length 13
  Top Layer w0.254: J5.1 68.82,68.58 从机.3
TX1: length 21.8
  Top Layer w0.254: 屏幕.3 37.08,65.49 J4.6
TX2: length 61.5
  Top Layer w0.254: U10.6 47.5,9.26 v1(47.5,6.34) ; v1(55.12,45.84) 65.11,45.84 65.22,45.72
  Bottom Layer w0.254: v1(55.12,45.84) 54.17,44.88 54.17,6.4 51.82,4.05 49.78,4.05 v1(47.5,6.34)
TX3: length 13
  Top Layer w0.254: J5.2 68.82,66.04 从机.4
UP: length 26.6
  Top Layer w0.254: J5.3 66.54,63.5 72.26,57.78 72.26,44.71 74.18,42.79 按键1.2
$1N2323: length 8.7
  Top Layer w0.254: R26.1 52.38,21.2 46.74,21.2 46.19,20.66 U10.24
$1N2324: length 3.5
  Top Layer w0.254: 49.02,22.42 49.03,22.41 52.54,22.41
$1N2327: length 3
  Top Layer w0.254: U11.2 42.51,9.17 U10.2
$1N2339: length 2.7
  Top Layer w0.254: C27.2 51.31,9.26 U10.9
$1N2342: length 7.5
  Top Layer w0.254: U10.13 C28.2 56.5,5.23 X2.1
$1N2343: length 18
  Top Layer w0.254: 57.69,9.29 U10.14 ; 57.69,9.29 63.64,9.29 64.73,8.2 64.73,4.01 63.76,3.03 61.27,3.03 ; 57.69,9.29 C29.2
$1N13204: length 42.5
  Top Layer w0.508: D4.1 36.58,33.36 33.16,33.36 32.93,33.59 32.93,33.65 32.16,34.41 26.26,34.41 25.49,33.65 25.49,33.59 25.26,33.36 22.61,33.36 D1.2 20.35,33.23 9.91,43.68 9.91,45.71 8v.2 8v.3
$1N13283: length 75.4
  Top Layer w0.254: 23.28,56.63 23.41,56.5
  Top Layer w0.508: R27.2 17.09,57.72 22.19,57.72 23.28,56.63 ; 5.3,30.61 3.05,32.86 3.05,52.69 4.06,53.71 8.13,53.71 19.91,41.93 D1.1 ; D1.1 22.48,56.08 C46.1 ; D1.1 26.67,41.93 D2.1
$1N13747: length 33.7
  Top Layer w0.508: 8v.1 5.84,45.84 20.07,31.61 24.95,31.61 26.44,33.11 D2.2 D3.1

## Copper pours and planes (outline as drawn; the poured copper is in the pictures)
GND on Top Layer: -5.21,81.02 85.85,81.02 85.85,-8.9 -5.21,-8.9
GND on Top Layer: -7.75,82.29 82.93,82.29 82.93,-1.79 -7.75,-1.79
GND on Bottom Layer: -2.54,81.14 83.95,81.14 83.95,-3.57 -2.54,-3.57

Small or netless copper shapes (teardrops, artwork), in the pictures only: 138 on Top Layer, 32 on Bottom Layer
